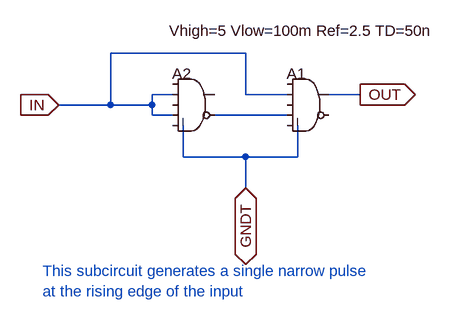
[diagram p0: schematic Small_pulse.asc]
Small_pulse.asc, the LTspice schematic file:
Version 4.1
SHEET 1 880 680
WIRE 16 64 -192 64
WIRE -96 128 -128 128
WIRE 16 128 16 64
WIRE 80 128 16 128
WIRE 192 128 144 128
WIRE -192 144 -192 64
WIRE -192 144 -272 144
WIRE -128 144 -128 128
WIRE -128 144 -192 144
WIRE -128 160 -128 144
WIRE -96 160 -128 160
WIRE 80 160 -32 160
WIRE -80 224 -80 176
WIRE 16 224 -80 224
WIRE 96 224 96 176
WIRE 96 224 16 224
WIRE 16 272 16 224
FLAG 16 272 GNDT
IOPIN 16 272 BiDir
FLAG 192 128 OUT
IOPIN 192 128 Out
FLAG -272 144 IN
IOPIN -272 144 In
SYMBOL Digital\\and 112 80 R0
WINDOW 0 -33 16 Left 2
SYMATTR InstName A1
SYMATTR SpiceLine Vhigh=5 Vlow=100m Ref=2.5
SYMBOL Digital\\and -64 80 R0
WINDOW 0 -33 16 Left 2
WINDOW 39 -38 -50 Left 2
SYMATTR InstName A2
SYMATTR SpiceLine Vhigh=5 Vlow=100m Ref=2.5 TD=50n
TEXT -296 400 Left 2 ;This subcircuit generates a single narrow pulse\nat the rising edge of the input

The netlist it stands for:
* Small_pulse.asc
A1 GNDT IN GNDT N001 GNDT GNDT OUT GNDT AND Vhigh=5 Vlow=100m Ref=2.5
A2 GNDT IN GNDT IN GNDT N001 GNDT GNDT AND Vhigh=5 Vlow=100m Ref=2.5 TD=50n
* This subcircuit generates a single narrow pulse
* at the rising edge of the input
.backanno
.end